# Altium schematic sheet Power_supply.SchDoc: Power supply
size A4; Date: 6.4.2015; Engineer: Matjaž Tome; DocumentNumber: 3; Revision: B; SheetNumber: 3; SheetTotal: 10; Project: USB DAQ
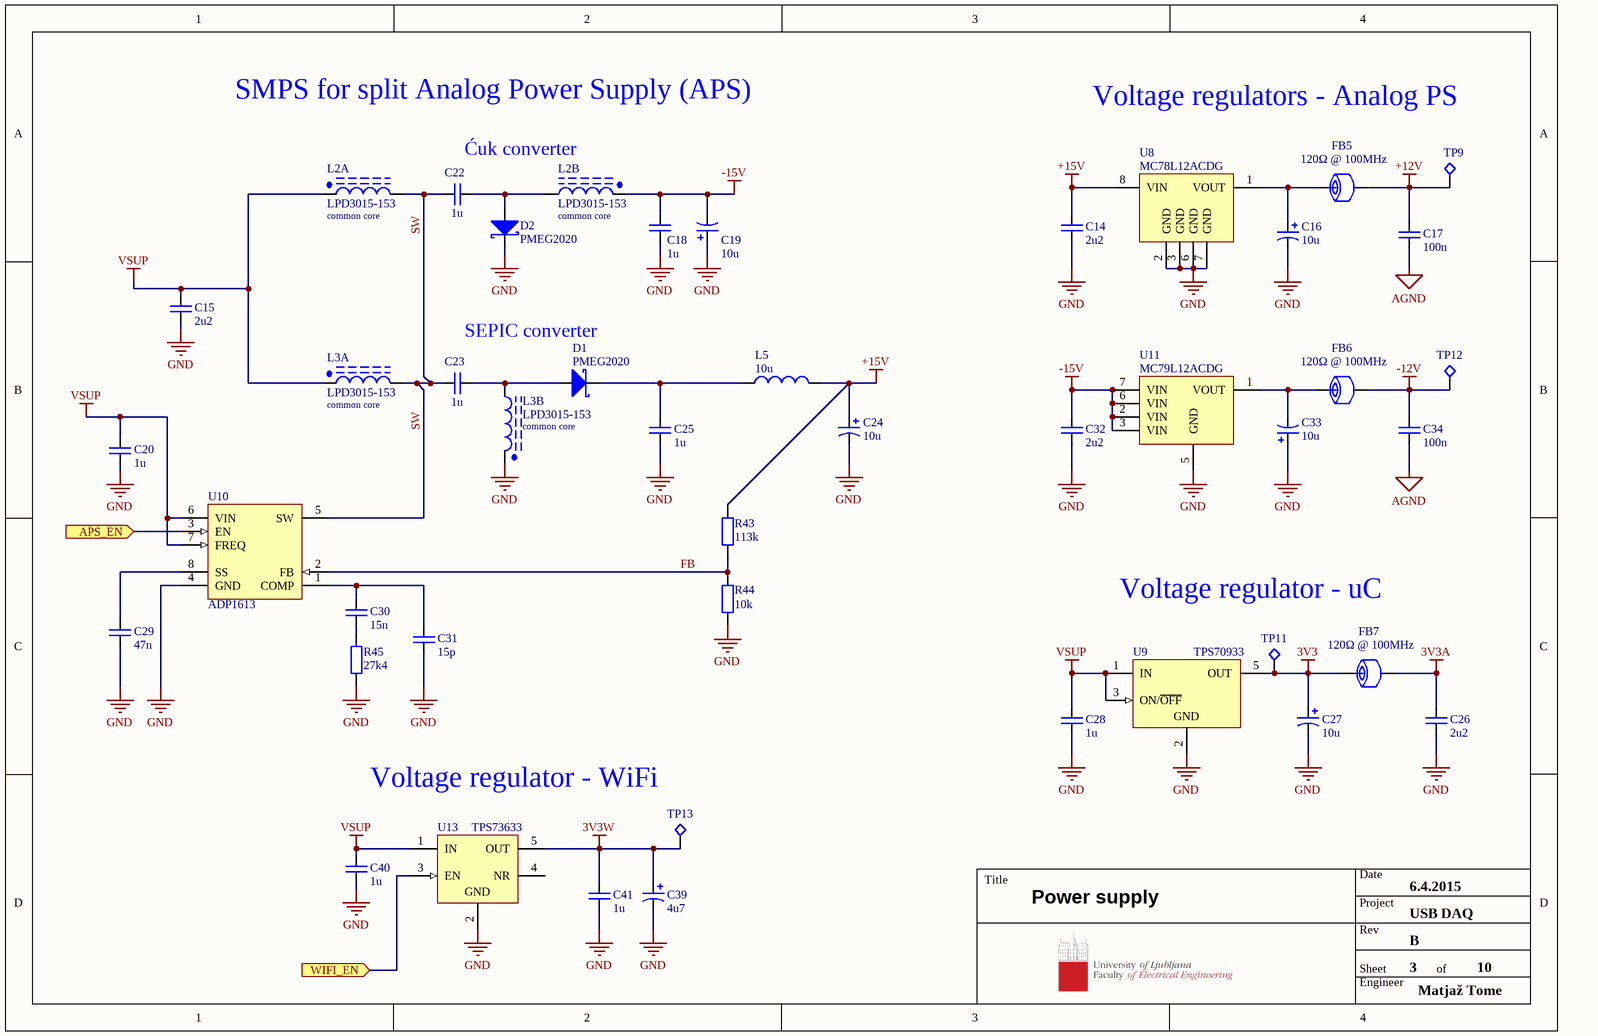
[diagram p0: Power_supply.SchDoc]

## Parts
C14  value 2u2  [C_0603]  (hidden comment: comment)
C15  value 2u2  [C_0603]  (hidden comment: comment)
C16  value 10u  [Tantalum Case A]  (hidden comment: comment)
C17  value 100n  [C_0603]  (hidden comment: comment)
C18  value 1u  [C_0603]  (hidden comment: comment)
C19  value 10u  [Tantalum Case A]  (hidden comment: comment)
C20  value 1u  [C_0603]  (hidden comment: comment)
C22  value 1u  [C_0603]  (hidden comment: comment)
C23  value 1u  [C_0603]  (hidden comment: comment)
C24  value 10u  [Tantalum Case A]  (hidden comment: comment)
C25  value 1u  [C_0603]  (hidden comment: comment)
C26  value 2u2  [C_0603]  (hidden comment: comment)
C27  value 10u  [Tantalum Case A]  (hidden comment: comment)
C28  value 1u  [C_0603]  (hidden comment: comment)
C29  value 47n  [C_0603]  (hidden comment: comment)
C30  value 15n  [C_0603]  (hidden comment: comment)
C31  value 15p  [C_0603]  (hidden comment: comment)
C32  value 2u2  [C_0603]  (hidden comment: comment)
C33  value 10u  [Tantalum Case A]  (hidden comment: comment)
C34  value 100n  [C_0603]  (hidden comment: comment)
C39  value 4u7  [Tantalum Case A]  (hidden comment: comment)
C40  value 1u  [C_0603]  (hidden comment: comment)
C41  value 1u  [C_0603]  (hidden comment: comment)
D1  PMEG2020  [SOD323]
D2  PMEG2020  [SOD323]
FB5  120Ω @ 100MHz  [SMD_0805]
FB6  120Ω @ 100MHz  [SMD_0805]
FB7  120Ω @ 100MHz  [SMD_0805]
L2  LPD3015-153  Note: common core  [LPD3015]  (parts A,B of 2)
L3  LPD3015-153  Note: common core  [LPD3015]  (parts A,B of 2)
L5  10u  [IND_SMD_4X4mm]
R43  value 113k  [R_0603]  (hidden comment: comment)
R44  value 10k  [R_0603]  (hidden comment: comment)
R45  value 27k4  [R_0603]  (hidden comment: comment)
TP9  testpoint  [TP1_FULL]  (value not drawn)
TP11  testpoint  [TP1_FULL]  (value not drawn)
TP12  testpoint  [TP1_FULL]  (value not drawn)
TP13  testpoint  [TP1_FULL]  (value not drawn)
U8  MC78L12ACDG  [SOIC8]
U9  TPS70933  [SOT23-5]
U10  ADP1613  [MSOP8]
U11  MC79L12ACDG  [SOIC8]
U13  TPS73633  [SOT23-5]

## Ports
APS_EN (in), WIFI_EN (in)

## Nets
3V3: C27.1 FB7.1 TP11.1 U9.5(OUT)
3V3A: C26.1 FB7.2
3V3W: C39.1 C41.1 TP13.1 U13.5(OUT)
+12V: C17.2 FB5.2 TP9.1
+15V: C14.1 C24.1 L5.2 R43.1 U8.8(VIN)
-12V: C34.2 FB6.2 TP12.1
-15V: C18.1 C19.2 C32.1 L2.4 U11.2(VIN) U11.3(VIN) U11.6(VIN) U11.7(VIN)
AGND: C17.1 C34.1
GND: C14.2 C15.1 C16.2 C18.2 C19.1 C20.2 C24.2 C25.2 C26.2 C27.2 C28.2 C29.2 C31.2 C32.2 C33.1 C39.2 C40.2 C41.2 D2.2(K) L3.4 R44.1 R45.1 U8.2(GND) U8.3(GND) U8.6(GND) U8.7(GND) U9.2(GND) U10.4(GND) U11.5(GND) U13.2(GND)
VSUP: C15.2 C20.1 C28.1 C40.1 L2.1 L3.1 U9.1(IN) U9.3(ON/~{OFF}) U10.6(VIN) U10.7(FREQ) U13.1(IN)
APS_EN: U10.3(EN) ; port APS_EN
FB: R43.2 R44.2 U10.2(FB)
SW: C22.1 C23.1 L2.2 L3.2 U10.5(SW)
WIFI_EN: U13.3(EN) ; port WIFI_EN
NetC16_1: C16.1 FB5.1 U8.1(VOUT)
NetC22_2: C22.2 D2.1(A) L2.3
NetC23_2: C23.2 D1.1(A) L3.3
NetC25_1: C25.1 D1.2(K) L5.1
NetC29_1: C29.1 U10.8(SS)
NetC30_1: C30.1 C31.1 U10.1(COMP)
NetC30_2: C30.2 R45.2
NetC33_2: C33.2 FB6.1 U11.1(VOUT)

Not connected (* = marked no-connect by the designer): U13 4(NR)

## Notes on the sheet
- SMPS for split Analog Power Supply (APS)
- Voltage regulators - Analog PS
- Ćuk converter
- SEPIC converter
- Voltage regulator - uC
- Voltage regulator - WiFi
- Title
- Date
- Project
- Rev
- Engineer
- Sheet
- of

## Library data of the parts
C14 C15 C17 C18 C20 C22 C23 C25 C26 C28-C32 C34 C40 C41 = Capacitor: Generic capacitor
C16 C19 C24 C27 C33 C39 = Capacitor - polarized: Generic polarized capacitor
D1 D2 = PMEG2020: Schottky diode, 2A 20V; Part Number: XDS0004; Manufacturer: Infineon; Manufacturer Number: PMEG2020AEA; Dealer number: 8737940; Dealer: Farnell; Category: diodes; Price: 0.126; Max  Reverse Voltage: 20V; Max current: 2A; Case: SOD323; Technology: SMT; HelpURL: https://www.farnell.com/datasheets/667013.pdf
FB5-FB7 = BLM21AG121SN1D: Ferrite Bead, 0805 [2012 Metric], 120 ohm, 800 mA, BLM21A Series, 0.15 ohm, ± 25%; Manufacturer: Murata; Dealer number: 1515617; Dealer: Farnell; DC resistance: 0.15Ω; Max current: 0.2A; Category: ferite beads; Price: 0.082; Manufacturer Number: BLM21AG121SN1D; AC resistance: 120Ω; Frequency: 100MHz; Case: 0805; Technology: SMT; HelpURL: https://www.farnell.com/datasheets/1914683.pdf
L2 L3 = LPD3015-153: Inductor, Coupled, 15 µH, 20%, 1.42 ohm, 460 mA, 3mm x 3mm x 1.4mm; Manufacturer: Coilcraft; Manufacturer Number: LPD3015-153MRB; Dealer number: 2407927; Dealer: Farnell; Value: 15µH; Current RMS: 460mA; Current Satturation: 500mA; Resistance: 1.42Ω; Category: Inductors; Price: 0.82; Case: LPD3015; Technology: SMT; Tolerance: 20%; HelpURL: https://www.farnell.com/datasheets/1805317.pdf
L5 = TYS4012100M-10: Power Inductor (SMD), 10 µH, 770 mA, Shielded, 800 mA, TYS Series, 4mm x 4mm x 1.2mm; Manufacturer: Laird Technologies; Dealer number: 2292514; Dealer: Farnell; Value: 10µH; Current RMS: 770mA; Current Satturation: 800mA; Resistance: 0.265Ω; Tolerance: 20%; Category: Inductors; Type: Power; Price: 0.26; Manufacturer Number: TYS4012100M-10; Case: 4mm X 4mm; Technology: SMT; HelpURL: https://www.farnell.com/datasheets/1685921.pdf
R43-R45 = Resistor: Generic resistor
TP9 TP11-TP13 = Test Point: testpoint 1.5mm diameter no hole; Part Number: XXC0006; Category: testpoints
U8 = 78LXX: 100 mA Positive Voltage Regulator; Part Number: XLR0006; Manufacturer: ON Semiconductors; Dealer number: 9666273; Dealer: Farnell; Output Voltage: 12V; Max input voltage: 35V; Output current: 100mA; Voltage tolerance: 5%; Teperature range: 0°C to +150°C; LDO: No; Category: Integrated circuits; Price: 0.43; Manufacturer Number: MC78L12ACDG; Low noise: No; Case: SOIC8; Technology: SMT; HelpURL: https://www.farnell.com/datasheets/2236920.pdf
U9 = TPS709XX: 1-µA IQ Voltage Regulators with Enable; Part Number: XLR0012; Manufacturer: Texas Instruments; Manufacturer Number: TPS70933DBVT; Dealer number: 2382995; Dealer: Farnell; Output Voltage: 3.3V; Max input voltage: 30V; Output current: 150mA; Teperature range: -40°C to +85°C; LDO: Yes; Low noise: No; Category: Integrated circuits; Price: 0.86; Case: SOT23-5; Technology: SMT; HelpURL: http://www.ti.com/general/docs/suppproductinfo.tsp?distId=26&gotoUrl=http%3A%2F%2Fwww.ti.com%2Flit%2Fgpn%2Ftps709
U10 = ADP161X: 650 kHz /1.3 MHz Step-Up PWM DC-to-DC Switching Converters / REGULATORS / Synchronous Step-Down DC-DC Converter; Part Number: XSW0008; Manufacturer: Analog devices; Manufacturer Number: ADP1613ARMZ-R7; Dealer number: 2102527; Dealer: Farnell; Switching element: Internal; Synchronious: No; Input voltage max: 5.5V; Input voltage min: 2.5V; Output voltage max: 20V; Output voltage min: 3.6V; Max output current: 1.5A; Category: Integrated circuits; Price: 1.63; Type: Boost; Case: MSOP8; Multyphaze: No; Ext Cock: No; Technology: SMT; HelpURL: https://eu.mouser.com/datasheet/2/609/ADP1612_1613-1503267.pdf
U11 = 79LXX: 100 mA Negative Voltage Regulator; Part Number: XLR0007; Manufacturer: ON Semiconductors; Dealer number: 1652361; Dealer: Farnell; Output Voltage: -12V; Max input voltage: -14V; Output current: 100mA; Voltage tolerance: 5%; Teperature range: 0°C to +150°C; LDO: No; Category: Integrated circuits; Price: 0.52; Manufacturer Number: MC79L12ACDG; Low noise: No; Case: SOIC8; Technology: SMT; HelpURL: https://www.farnell.com/datasheets/2255359.pdf
U13 = TPS736XX: Cap-Free, NMOS, 400-mA Low-Dropout Regulator with Reverse Current Protection; Part Number: XLR0013; Manufacturer: Texas instruments; Manufacturer Number: TPS73633DBV; Dealer number: 1207346; Dealer: Farnell; Output Voltage: 3.3V; Max input voltage: 5.5V; Output current: 400mA; Voltage tolerance: 1%; Teperature range: -40°C to +125°C; LDO: Yes; Low noise: No; Category: Integrated circuits; Price: 2.53; Case: SOT23-5; Technology: SMT; HelpURL: http://www.ti.com/general/docs/suppproductinfo.tsp?distId=26&gotoUrl=http%3A%2F%2Fwww.ti.com%2Flit%2Fgpn%2Ftps736